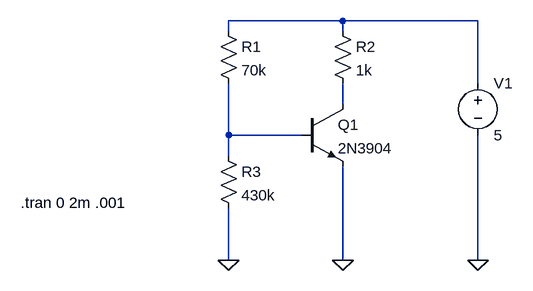
[diagram p0: schematic Draft1.asc]
Draft1.asc, the LTspice schematic file:
Version 4
SHEET 1 880 680
WIRE 400 144 224 144
WIRE 608 144 400 144
WIRE 224 160 224 144
WIRE 400 160 400 144
WIRE 608 240 608 144
WIRE 400 272 400 240
WIRE 224 320 224 240
WIRE 336 320 224 320
WIRE 224 352 224 320
WIRE 224 512 224 432
WIRE 400 512 400 368
WIRE 608 512 608 320
FLAG 400 512 0
FLAG 224 512 0
FLAG 608 512 0
SYMBOL Res 208 144 R0
SYMATTR InstName R1
SYMATTR Value 70k
SYMBOL Res 384 144 R0
SYMATTR InstName R2
SYMATTR Value 1k
SYMBOL Res 208 336 R0
SYMATTR InstName R3
SYMATTR Value 430k
SYMBOL Voltage 608 224 R0
SYMATTR InstName V1
SYMATTR Value 5
SYMBOL npn 336 272 R0
SYMATTR InstName Q1
SYMATTR Value 2N3904
TEXT -96 424 Left 2 !.tran 0 2m .001

The netlist it stands for:
* Draft1.asc
R1 N001 N003 70k
R2 N001 N002 1k
R3 N003 0 430k
V1 N001 0 5
Q1 N002 N003 0 0 2N3904
.model NPN NPN
.model PNP PNP
.lib standard.bjt
.tran 0 2m .001
.backanno
.end